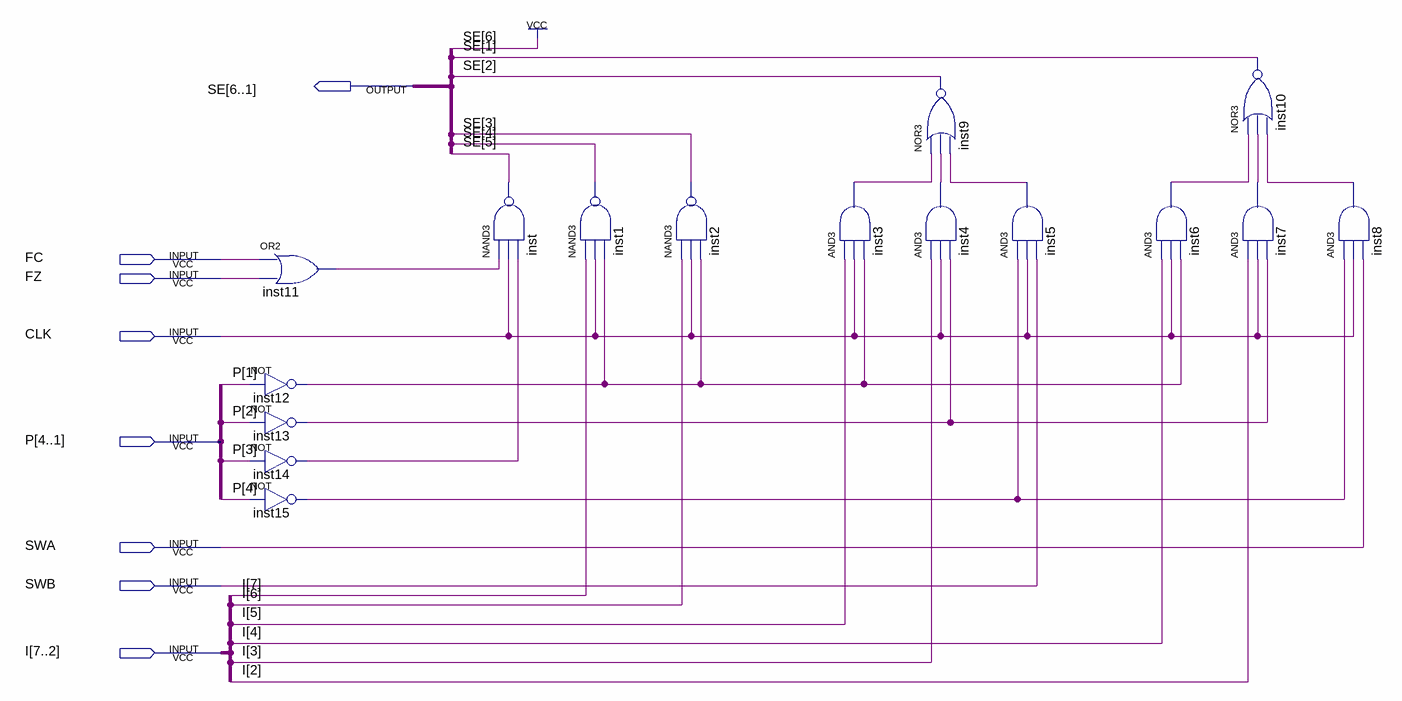
[diagram p0: schematic sheet]
// Quartus schematic exp51.bdf as structural Verilog: 16 symbols, 8 pins
module exp51 (
  input  FC,
  input  FZ,
  input  CLK,
  input  [4:1] P,
  input  SWA,
  input  SWB,
  input  [7:2] I,
  output [6:1] SE
);

  wire inst3_out, inst4_out, inst5_out, inst6_out, inst7_out, inst8_out, inst11_out, inst12_out, inst13_out,
       inst14_out, inst15_out;

  or inst11 (inst11_out, FC, FZ);
  not inst12 (inst12_out, P[1]);
  not inst13 (inst13_out, P[2]);
  not inst14 (inst14_out, P[3]);
  not inst15 (inst15_out, P[4]);
  nand inst (SE[5], inst11_out, CLK, inst14_out);
  nand inst1 (SE[4], I[7], CLK, inst12_out);
  nand inst2 (SE[3], I[6], CLK, inst12_out);
  and inst3 (inst3_out, I[5], CLK, inst12_out);
  nor inst9 (SE[2], inst3_out, inst4_out, inst5_out);
  and inst4 (inst4_out, I[3], CLK, inst13_out);
  and inst5 (inst5_out, inst15_out, CLK, SWB);
  and inst6 (inst6_out, I[4], CLK, inst12_out);
  nor inst10 (SE[1], inst6_out, inst7_out, inst8_out);
  and inst7 (inst7_out, I[2], CLK, inst13_out);
  and inst8 (inst8_out, inst15_out, CLK, SWA);

  assign SE[6] = 1'b1;
endmodule
